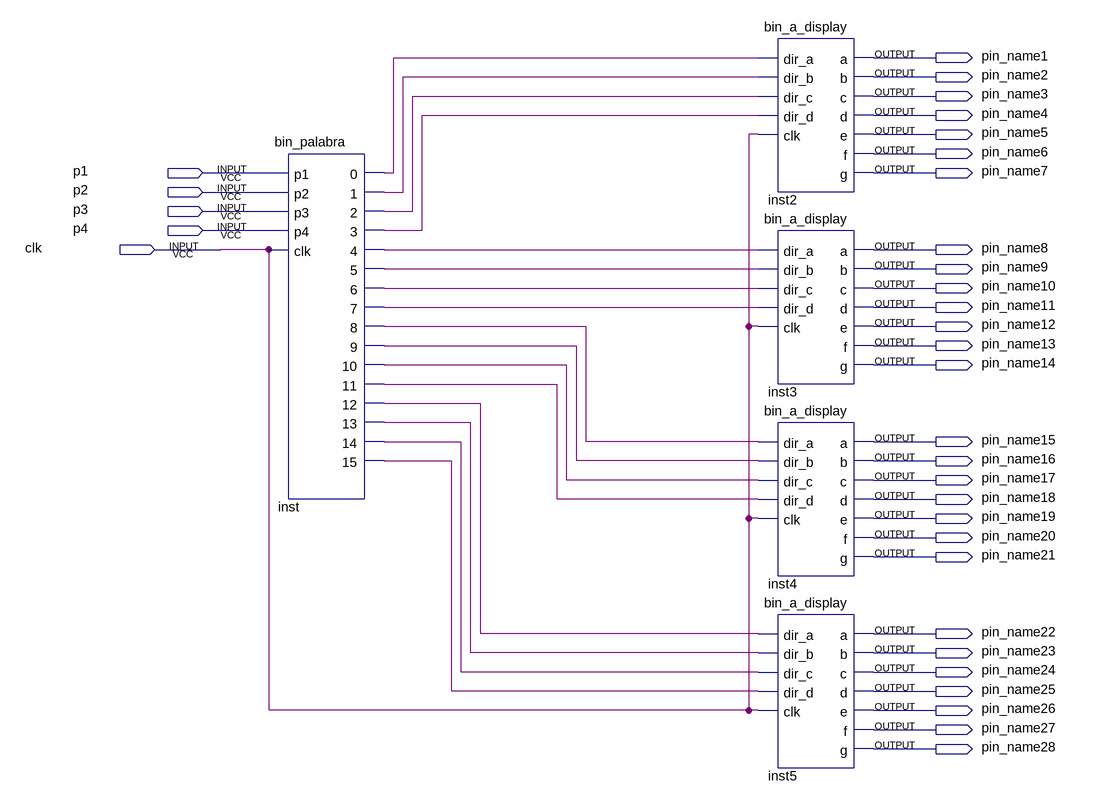
[diagram p0: schematic sheet]
// Quartus schematic mostrar_palabras.bdf as structural Verilog: 5 symbols, 33 pins
module mostrar_palabras (
  input  p1,
  input  p2,
  input  p3,
  input  p4,
  input  clk,
  output pin_name1,
  output pin_name2,
  output pin_name3,
  output pin_name4,
  output pin_name5,
  output pin_name6,
  output pin_name7,
  output pin_name8,
  output pin_name9,
  output pin_name10,
  output pin_name11,
  output pin_name12,
  output pin_name13,
  output pin_name14,
  output pin_name15,
  output pin_name16,
  output pin_name17,
  output pin_name18,
  output pin_name19,
  output pin_name20,
  output pin_name21,
  output pin_name22,
  output pin_name23,
  output pin_name24,
  output pin_name25,
  output pin_name26,
  output pin_name27,
  output pin_name28
);

  wire inst_0, inst_1, inst_2, inst_3, inst_4, inst_5, inst_6, inst_7, inst_8, inst_9, inst_10, inst_11,
       inst_12, inst_13, inst_14, inst_15;

  bin_palabra inst (
    .p1(p1), .p2(p2), .p3(p3), .p4(p4), .clk(clk), .\0 (inst_0), .\1 (inst_1), .\2 (inst_2), .\3 (inst_3),
    .\4 (inst_4), .\5 (inst_5), .\6 (inst_6), .\7 (inst_7), .\8 (inst_8), .\9 (inst_9), .\10 (inst_10),
    .\11 (inst_11), .\12 (inst_12), .\13 (inst_13), .\14 (inst_14), .\15 (inst_15));
  bin_a_display inst2 (
    .dir_a(inst_0), .dir_b(inst_1), .dir_c(inst_2), .dir_d(inst_3), .clk(clk), .a(pin_name1), .b(pin_name2),
    .c(pin_name3), .d(pin_name4), .e(pin_name5), .f(pin_name6), .g(pin_name7));
  bin_a_display inst3 (
    .dir_a(inst_4), .dir_b(inst_5), .dir_c(inst_6), .dir_d(inst_7), .clk(clk), .a(pin_name8), .b(pin_name9),
    .c(pin_name10), .d(pin_name11), .e(pin_name12), .f(pin_name13), .g(pin_name14));
  bin_a_display inst4 (
    .dir_a(inst_8), .dir_b(inst_9), .dir_c(inst_10), .dir_d(inst_11), .clk(clk), .a(pin_name15),
    .b(pin_name16), .c(pin_name17), .d(pin_name18), .e(pin_name19), .f(pin_name20), .g(pin_name21));
  bin_a_display inst5 (
    .dir_a(inst_12), .dir_b(inst_13), .dir_c(inst_14), .dir_d(inst_15), .clk(clk), .a(pin_name22),
    .b(pin_name23), .c(pin_name24), .d(pin_name25), .e(pin_name26), .f(pin_name27), .g(pin_name28));
endmodule
